# EAGLE design JDM2-2voltage-new (EAGLE 7.6.0)
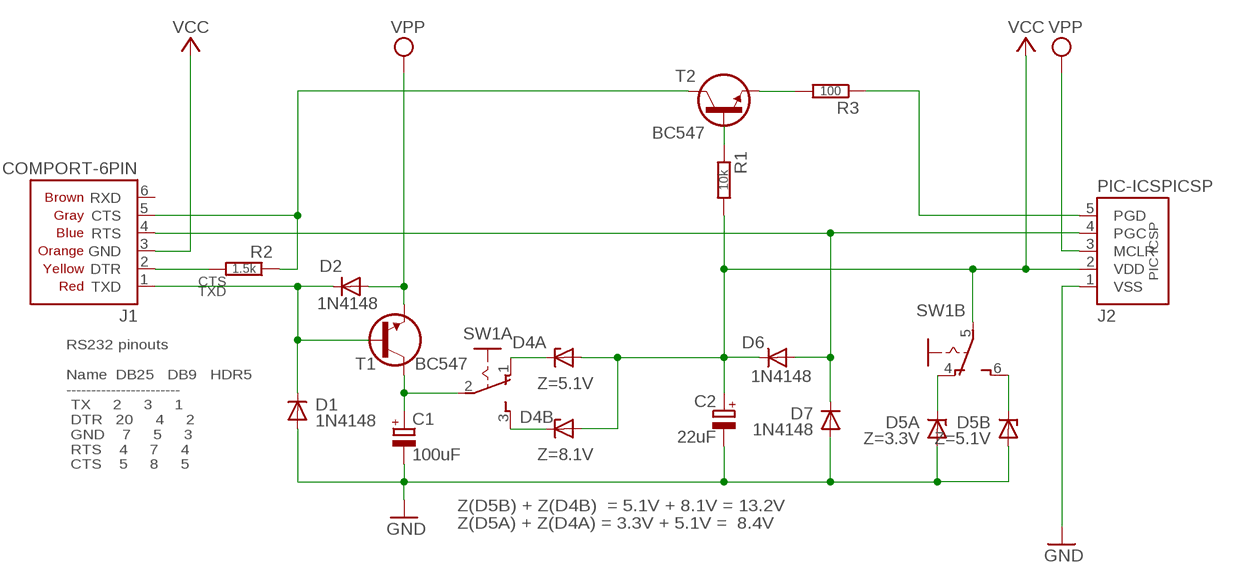
[diagram p0: schematic, sheet 1]

## Parts
C1  100uF  CPOLE2.5-5  [E2,5-5]
C2  22uF  CPOLE2,5-4  [E2,5-4]
D1  1N4148  1N414834-5V  [DO34-5V]
D2  1N4148  1N414834-7V  [DO34-7V]
D4A  Z=5.1V  Z-DIODE34Z5  [DO34Z5]
D4B  Z=8.1V  Z-DIODE34Z5  [DO34Z5]
D5A  Z=3.3V  Z-DIODE34Z7V  [DO34Z7V]
D5B  Z=5.1V  Z-DIODE34Z7V  [DO34Z7V]
D6  1N4148  1N414834-7V  [DO34-7V]
D7  1N4148  1N414834-5V  [DO34-5V]
J1  COMPORT-6PIN  [RS232-6PIN]
J2  PIC-ICSPICSP  [PIC-ICSP]
R1  10k  R0202/7-V  [0202/7-V]
R2  1.5k  R0202/7-V  [0202/7-V]
R3  100  R0202/7  [0202/7]
SW1  SL-SW-2P-2T-S  [SLSW-2P2T-H]
T1  BC547  BC547CBE  [TO92-CBE]
T2  BC547  BC547CBE  [TO92-CBE]

## Nets
/MCLR: D2.A J2.3(MCLR) T1.E ; supply symbol labelled VPP
CLK: D6.A D7.C J1.4(RTS) J2.4(PGC)
CTS: J1.5(CTS) R2.1 T2.C
DATA: R3.2 T2.E
GND: C1.- C2.- D1.A D5A.A D5B.A D7.A J2.1(VSS)
N$1: R1.1 T2.B
N$3: D5A.C SW1.4(B:O)
N$4: D4B.C SW1.3(A:S)
N$5: C1.+ SW1.2(A:P) T1.C
N$6: D5B.C SW1.6(B:S)
N$7: J1.2(DTR) R2.2
PGD: J2.5(PGD) R3.1
TXD: D1.C D2.C J1.1(TXD) T1.B
VCC: C2.+ D4A.A D4B.A D6.C J1.3(GND) J2.2(VDD) R1.2 SW1.5(B:P)
VPP: D4A.C SW1.1(A:O)
Unconnected: J1.6(RXD)

## Notes on the sheet
- RS232 pinouts
  
  Name  DB25   DB9   HDR5
  -----------------------
   TX     2     3     1
   DTR   20     4     2
   GND    7     5     3
   RTS    4     7     4
   CTS    5     8     5
- Z(D5B) + Z(D4B)  = 5.1V + 8.1V = 13.2V
  Z(D5A) + Z(D4A) = 3.3V + 5.1V =  8.4V

## Library data of the parts
C1 C2 = c:CPOL: POLARIZED CAPACITOR, European symbol
D1 D2 D6 D7 = d:1N4148
D4A D4B D5A D5B = d:Z-DIODE
J1 = pinconn:COMPORT-6PIN
J2 = pinconn:PIC-ICSP
R1-R3 = r:R: RESISTOR, European symbol
SW1 = sw:SL-SW-2P-2T-S
T1 T2 = t:BC547

## Net classes
0 default: width 0.559 mm
1 power: width 0.559 mm

## Board
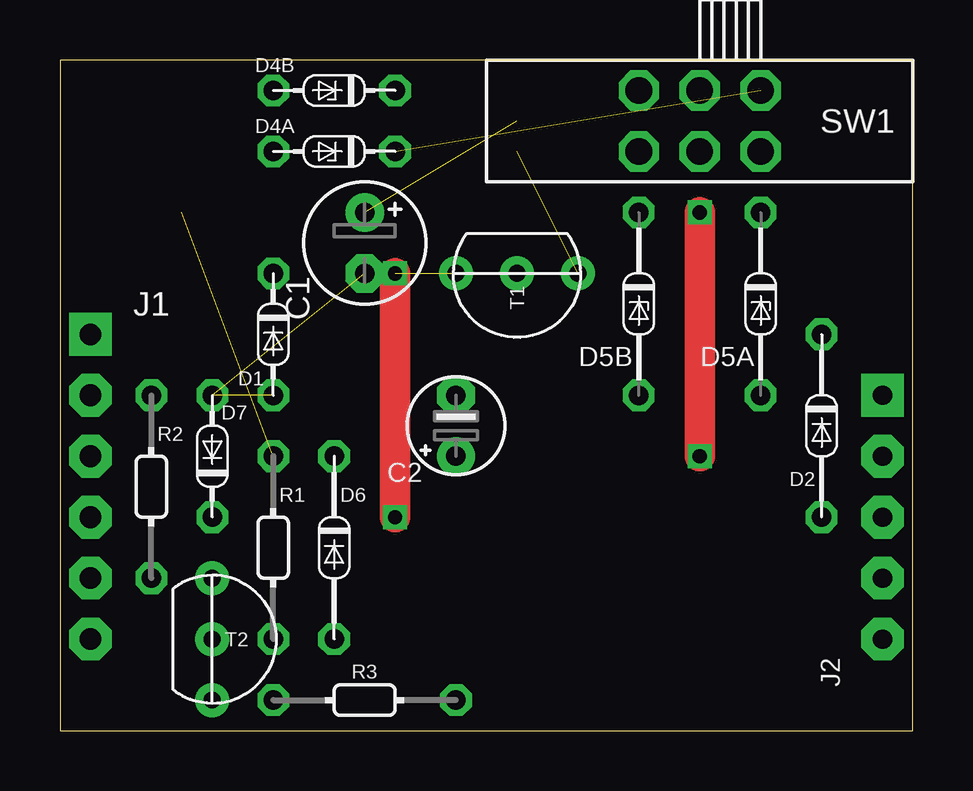
[diagram p1: board, top side]
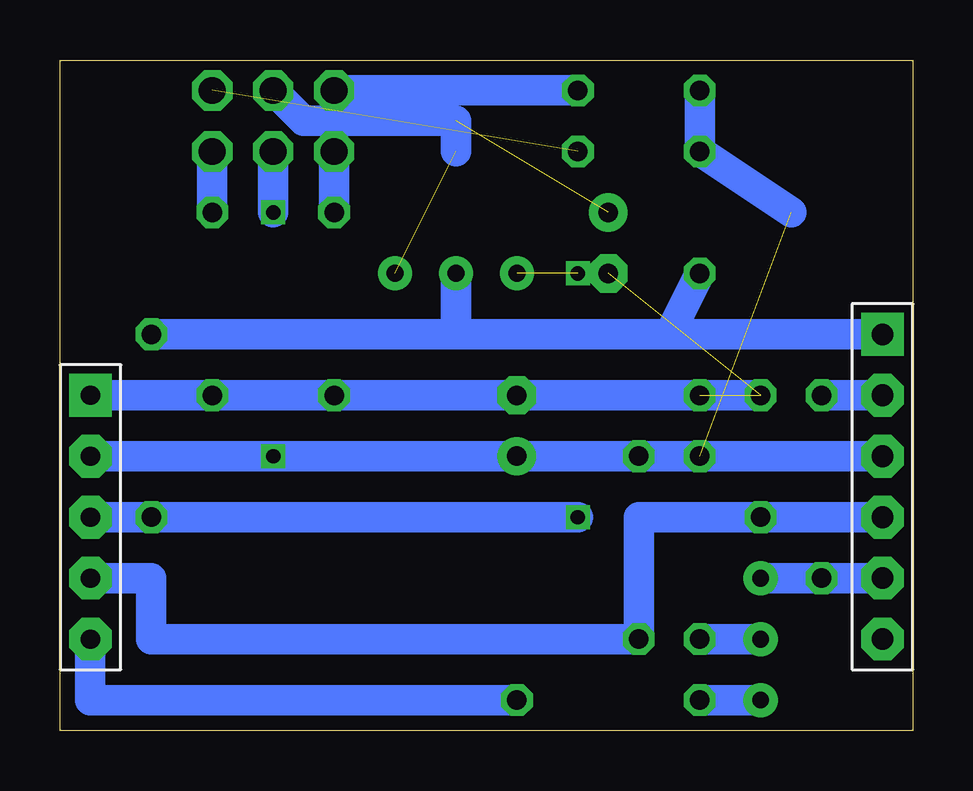
[diagram p2: board, bottom side, seen from below]

Size 35.56 x 27.94 mm. Coordinates in mm from the lower left corner, seen from the top.
Outline: 35.56,0 35.56,27.94 0,27.94 0,0 35.56,0
Copper layers (1*16): Top 0.035mm / dielectric 1.5mm / Bottom 0.035mm
Design rules "default": minimum track width 10mil, minimum drill 24mil, track to track 8mil, track to pad 8mil, pad to pad 8mil, via to via 8mil, smd to smd 8mil, copper to edge 40mil, drill to drill 8mil, minimum pad ring 10mil, minimum via ring 8mil, stop-mask expansion 4mil, vias tented up to drill 0mil, thermal gap 10mil

### Footprints (pad centres in the part's own frame; a part is rotated, then mirrored left to right if it is on the bottom)
E2,5-5 = drill 0.813 pad 1.6: + 1.27,0 | drill 0.813 pad 1.6 octagon: - -1.27,0
E2,5-4 = drill 0.813 pad 1.6: + 0,-1.27 | drill 0.813 pad 1.6 octagon: - 0,1.27
DO34-5V = drill 0.813 octagon: A 0,2.54; C 0,-2.54
DO34-7V = drill 0.813 octagon: A 0,3.81; C 0,-3.81
DO34Z5 = drill 0.813 octagon: A -2.54,0; C 2.54,0
DO34Z7V = drill 0.813 octagon: A 0,3.81; C 0,-3.81
RS232-6PIN = drill 0.9 pad 1.778 square: 1 0,0 | drill 0.9 pad 1.778 octagon: 2 2.54,0; 3 5.08,0; 4 7.62,0; 5 10.16,0; 6 12.7,0
PIC-ICSP = drill 0.8 pad 1.778 square: 1 -5.08,0 | drill 0.8 pad 1.778 octagon: 2 -2.54,0; 3 0,0; 4 2.54,0; 5 5.08,0
0202/7-V = drill 0.813 octagon: 1 0,-3.81; 2 0,3.81
0202/7 = drill 0.813 octagon: 1 -3.81,0; 2 3.81,0
SLSW-2P2T-H = drill 1.118 pad 1.524 octagon: 1 2.54,1.27; 2 0,1.27; 3 -2.54,1.27; 4 2.54,-1.27; 5 0,-1.27; 6 -2.54,-1.27
TO92-CBE = drill 0.7 pad 1.422: B 0,0; C 0,2.54; E 0,-2.54

### Placement (x,y rotation side)
C1  12.7,20.32 90 top
C2  16.51,12.7 0 top
D1  8.89,16.51 180 top
D2  31.75,12.7 180 top
D4A  11.43,24.13 0 top
D4B  11.43,26.67 0 top
D5A  29.21,17.78 180 top
D5B  24.13,17.78 180 top
D6  11.43,7.62 180 top
D7  6.35,11.43 0 top
J1  1.27,16.51 270 top
J2  34.29,8.89 270 top
R1  8.89,7.62 0 top
R2  3.81,10.16 0 top
R3  12.7,1.27 180 top
SW1  26.67,25.4 0 top
T1  19.05,19.05 270 top
T2  6.35,3.81 0 top

### Tracks (layer width: path | path; a pad name or v marks a point on that pad's centre or on a via)
/MCLR  (via drill 0.6)  (1 unrouted)
  Top 1.27: v13.97,8.89 v13.97,19.05
  Bottom 1.27: J2.3 D2.A v13.97,8.89
CLK
  Bottom 1.27: J2.4 31.75,6.35 31.75,3.81 D6.A 11.43,8.89 J1.4 D7.C
CTS
  Bottom 1.27: J1.5 R2.1 T2.C
DATA  (via drill 0.6)
  Bottom 1.27: T2.E R3.2
  other vias: 6.35,1.27 6.35,1.27
GND  (2 unrouted)
  Bottom 1.27: J2.1 D5A.A D5B.A C2.- D7.A
N$1
  Bottom 1.27: R1.1 T2.B
N$3
  Bottom 1.27: D5A.C SW1.4
N$4
  Bottom 1.27: SW1.3 D4B.C
N$5  (2 unrouted)
  Bottom 1.27: SW1.2 25.4,25.4 19.05,25.4 19.05,24.13
N$6
  Bottom 1.27: D5B.C SW1.6
N$7
  Bottom 1.27: R2.2 J1.2
PGD
  Bottom 1.27: J2.5 34.29,1.27 R3.1
TXD
  Bottom 1.27: D2.C 19.05,16.51 | J1.1 10.16,16.51 | 10.16,16.51 19.05,16.51 | 19.05,16.51 T1.B | D1.C 10.16,16.51
VCC  (via drill 0.6)  (1 unrouted)
  Top 1.27: v26.67,11.43 v26.67,21.59
  Bottom 1.27: J2.2 v26.67,11.43 C2.+ D6.C R1.2 J1.3 | v26.67,21.59 SW1.5 | D4B.A D4A.A 5.08,21.59
VPP  (1 unrouted)

### Text on the board
Dimension: 10 | 9 | 8 | 7 | 6 | 5 | 4 | 3 | 2 | 1 | 1 | 2 | 3 | 4 | 5 | 6 | 7 | 8 | 9 | 10 | 11 | 12 | 13 | 14